# Altium schematic sheet Mechanical.SchDoc: Mechanical
size A4; Date: Not used; ApprovedBy: Not used; CheckedBy: Not used; Author: Not used; CompanyName: STMicroelectronics; DrawnBy: Not used; Engineer: Not used; Organization: Not used; Address1: Not used; Address2: Not used; Address3: Not used; Address4: Not used; DocumentNumber: Not used; Revision: Not used; SheetNumber: 11; SheetTotal: 12; CurrentTime: Not used; CurrentDate: Not used; Time: Not used; DocumentFullPathAndName: Not used; DocumentName: Not used; ModifiedDate: Not used; ImagePath: Not used; ProjectName: Not used; Application_BuildNumber: Not used
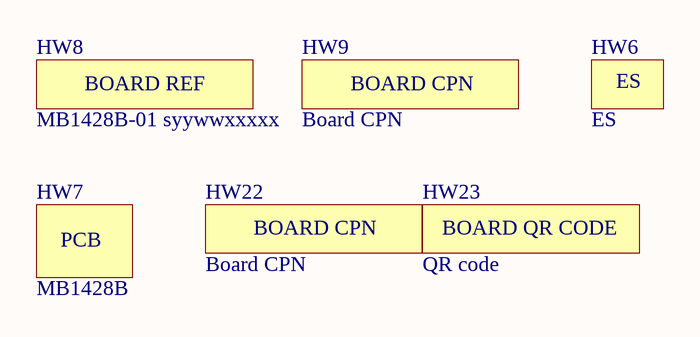
[diagram p0: Mechanical.SchDoc]

## Parts
HW6  value ES  (mechanical)
HW7  value MB1428B  (mechanical)
HW8  value MB1428B-01 syywwxxxxx  [STICKER_25X9]  (mechanical)
HW9  value Board CPN  [STICKER_25X9]  (mechanical)
HW22  value Board CPN  [STICKER_BOARD-CPN_13X3]  (mechanical)
HW23  value QR code  [STICKER_BOARD-QR-CODE_9X9]  (mechanical)

## Notes on the sheet
- Title:
- Project:
- Size:
- Revision:
- Variant:
- A4
- -
- Date:
- Reference:
- Sheet:
- of
- (in symbol MCD-00235) BOARD REF
- (in symbol MCD-00547) BOARD CPN
- (in symbol MCD-01470) BOARD CPN
- (in symbol MCD-01471) BOARD QR CODE

## Library data of the parts
HW6 = MCD-00234: Sticker to mention ES sample; Part_Type: Mechanical; Provided_By: SUBCO; Internal_Part_Number: MCD-00234; Status: Released; Manufacturer_Part_Number: n/a; Manufacturer: n/a; ComponentLink1Description: Datasheet
HW7 = MCD-00216: PCB, xxxx for PCB number, Y for PCB revision; Part_Type: Mechanical; Provided_By: SUBCO; Internal_Part_Number: MCD-00216; Status: Released; Manufacturer_Part_Number: n/a; Manufacturer: n/a; ComponentLink1Description: Datasheet
HW8 = MCD-00235: Sticker to mention board reference + serial number; Part_Type: Mechanical; Provided_By: SUBCO; Internal_Part_Number: MCD-00235; Status: Released; Manufacturer_Part_Number: n/a; Manufacturer: n/a; ComponentLink1Description: Datasheet; ComponentLink1URL: n/a
HW9 = MCD-00547: Sticker to mention board CPN code; Part_Type: Mechanical; Provided_By: SUBCO; Internal_Part_Number: MCD-00547; Status: Released; Manufacturer_Part_Number: n/a; Manufacturer: n/a; ComponentLink1Description: Datasheet; ComponentLink1URL: NA
HW22 = MCD-01470: Small sticker to mention board CPN (6 digits CPN + last ones FG); Part_Type: Mechanical; Provided_By: SUBCO; Internal_Part_Number: MCD-01470; Status: Footprint available; Manufacturer_Part_Number: n/a; Manufacturer: n/a; ComponentLink1Description: Datasheet; ComponentLink1URL: n/a
HW23 = MCD-01471: Sticker to mention QR code dor small board size (ie Nucleo-32); Part_Type: Mechanical; Provided_By: SUBCO; Internal_Part_Number: MCD-01471; Status: Footprint available; Manufacturer_Part_Number: n/a; Manufacturer: n/a; ComponentLink1Description: Datasheet; ComponentLink1URL: n/a